# EasyEDA schematic wigler_ariel.json
TITLE: Sheet_1; REV: 1.0; Date: 2025-09-19; Sheet: 1/1; Drawn By: nath8505; Company: Your Company
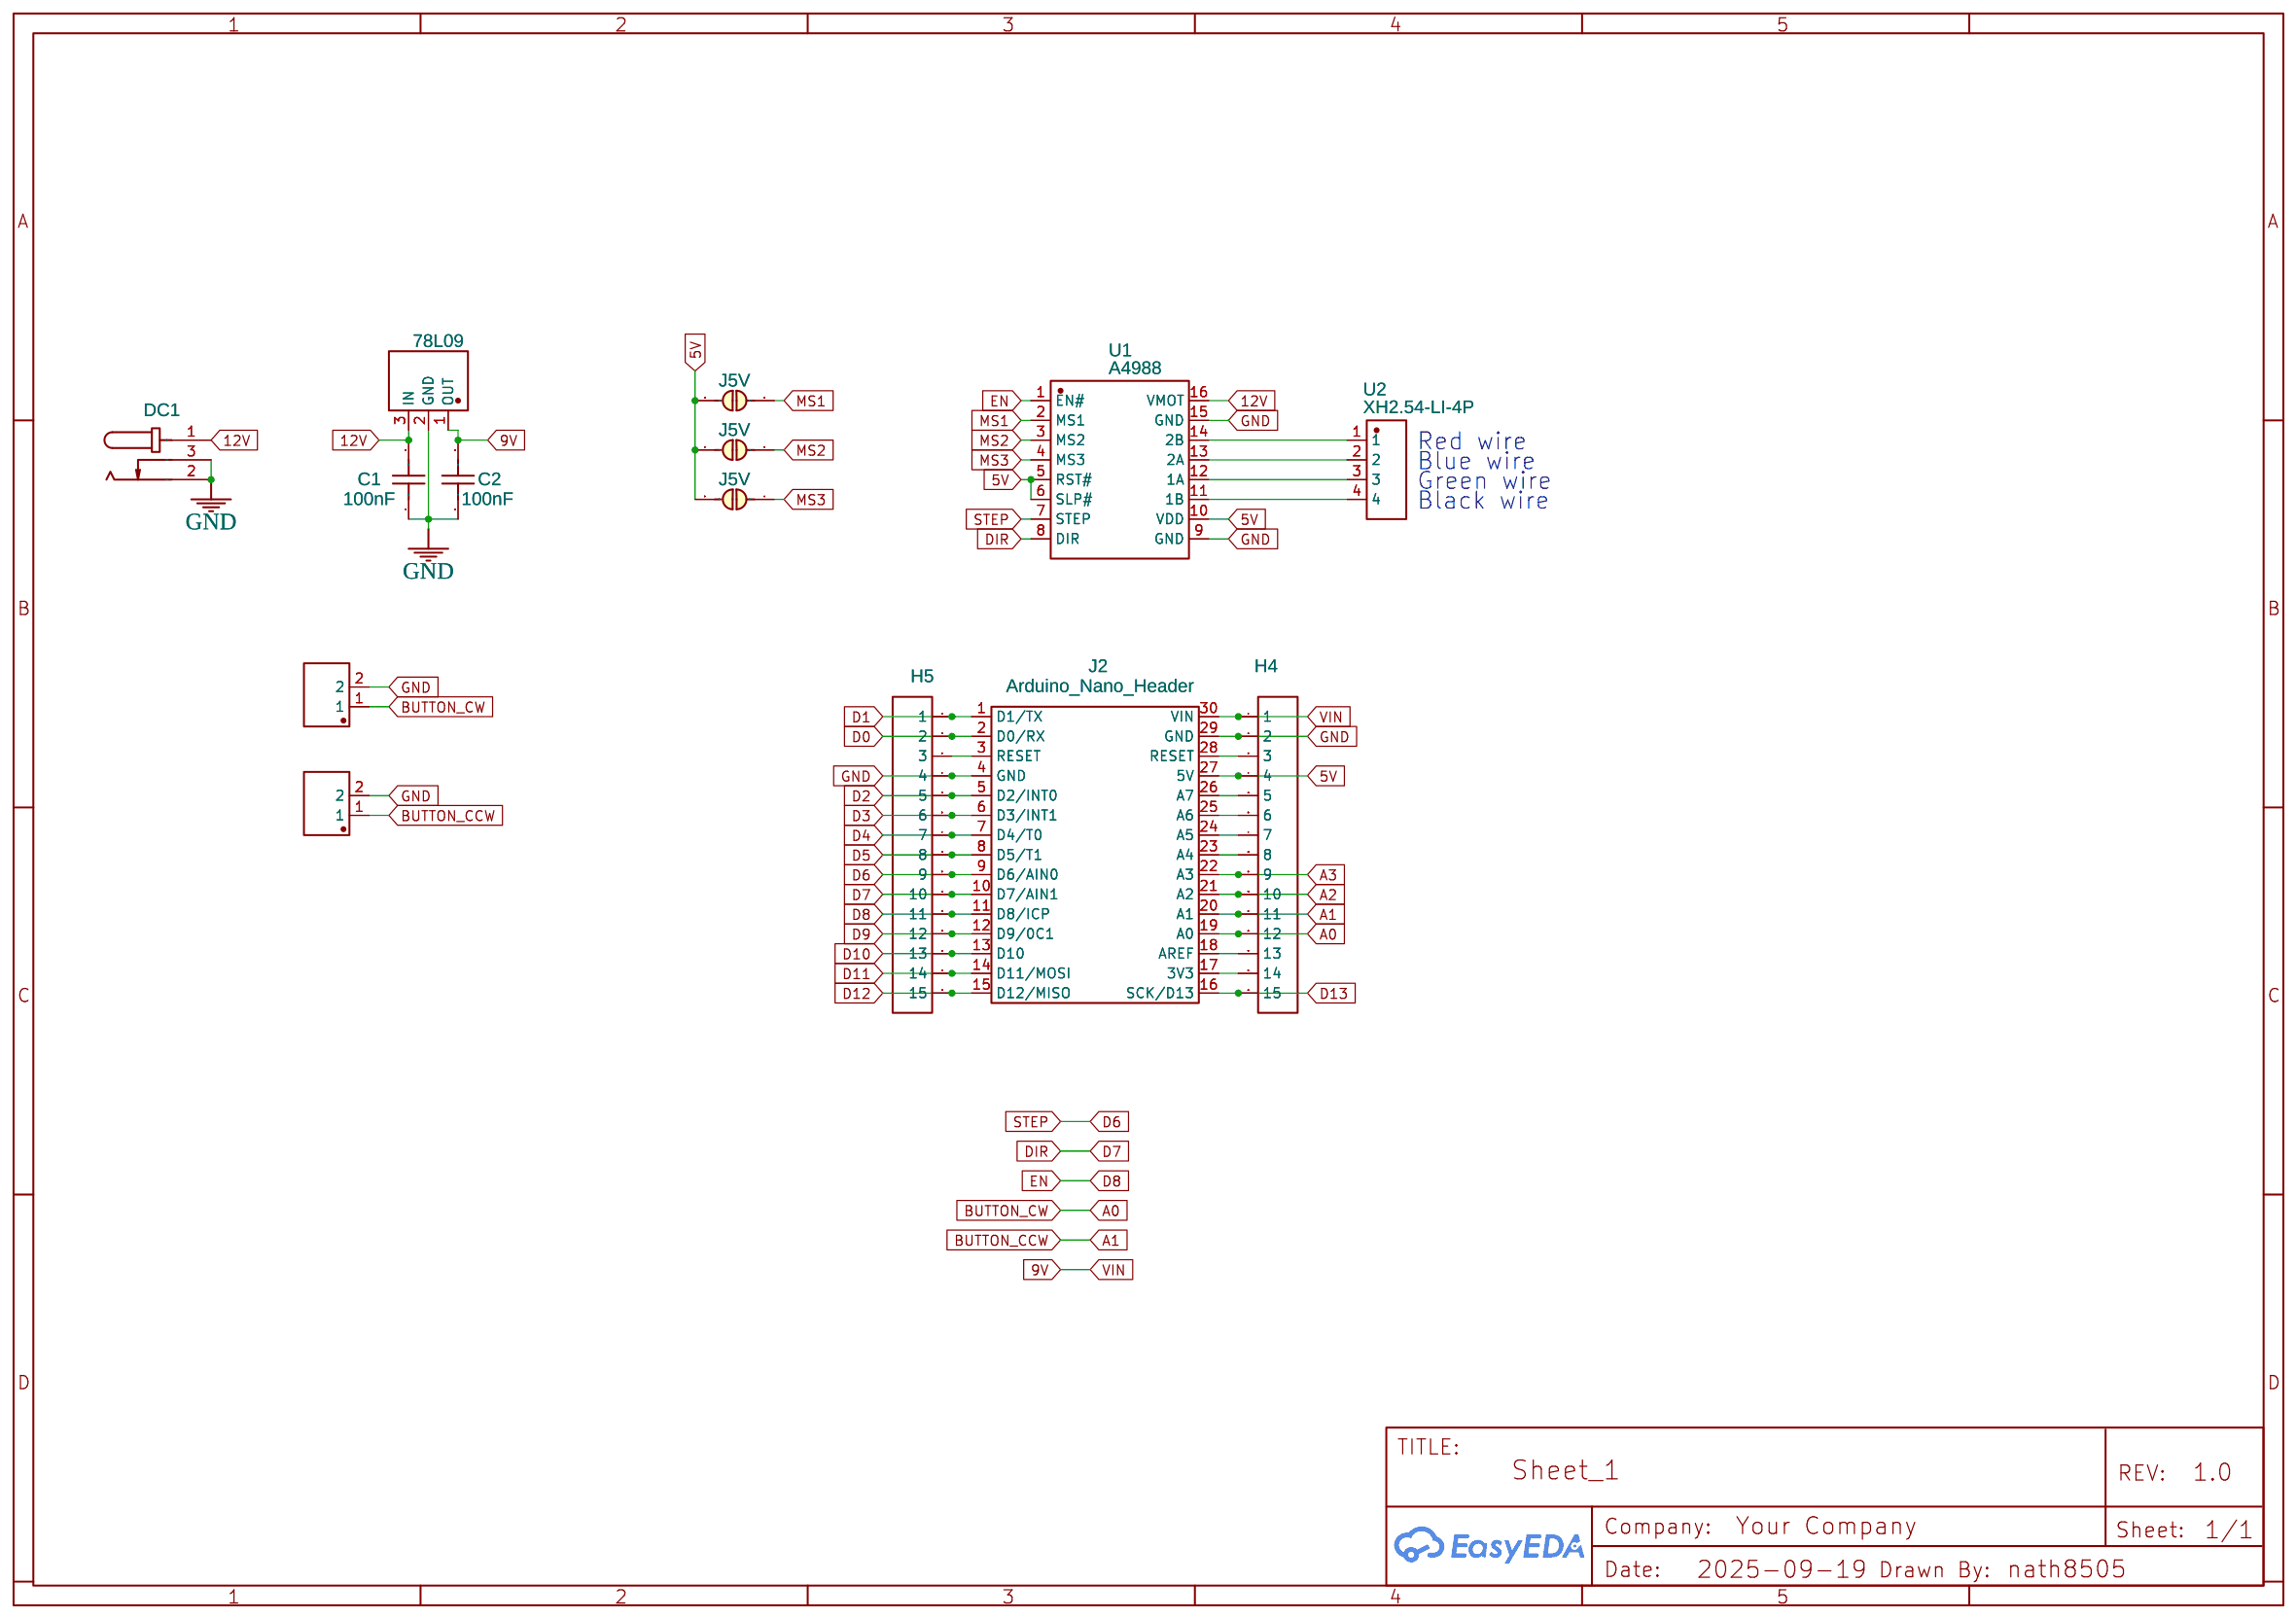
[diagram p0: schematic sheet]

## Parts
C1  100nF  [C0603]
C2  100nF  [C0603]
D7  B+  [CONN-TH_KF2510-2A]
D8  B-  [CONN-TH_KF2510-2A]
DC1  DC  [DC-IN-TH_DC005]
H4  HDR-F-2.54_1x15  [HDR-F-2.54_1X15]
H5  HDR-F-2.54_1x15  [HDR-F-2.54_1X15]
J2  Arduino_Nano_Header  [DIP-30_L43.18-W15.24-ARDUINONANO]
J9V_1  J5V  [JUMPERS_SMT-JUMPER_2_NC_PASTE_NO-SILK]
J9V_2  J5V  [JUMPERS_SMT-JUMPER_2_NC_PASTE_NO-SILK]
J9V_3  J5V  [JUMPERS_SMT-JUMPER_2_NC_PASTE_NO-SILK]
U1  A4988  [DIP-16_L20.3-W15.2-P2.54_LS12.7_A4988]
U2  XH2.54-LI-4P  [CONN-TH_4P-P2.54-XH2.54-LI-4P]
U3  78L09  [SOT-89-3_L4.5-W2.5-P1.50-LS4.0-BR]

## Library data of the parts
C1 C2 = CC0603KRX7R9BB104: Supplier: LCSC; Manufacturer: YAGEO(国巨); Supplier Part: C14663; JLCPCB Part Class: Basic Part
D7 D8 = KF2510-2A: Supplier: LCSC; Manufacturer: BOOMELE; Supplier Part: C27543; JLCPCB Part Class: Extended Part; Package Display: No
DC1 = DC005-2.0MM: Supplier: LCSC; Manufacturer: SOFNG; Supplier Part: C111567; Package Display: No
H4 H5 = HDR-F-2.54_1x15: Supplier Part: C124408; Supplier: LCSC; Contributor: LCEDA_Lib; Package Display: No
J2 = Arduino_Nano_Header
J9V_1-J9V_3 = JUMPER-SMT_2: Contributor: P-Thomsen; Package Display: No
U1 = A4988: Supplier: LCSC; Supplier Part: C9900168373; Manufacturer: null; Contributor: lcsc
U2 = XH2.54-LI-4P: Contributor: LCSC; Supplier: LCSC; Supplier Part: C9900008626; Manufacturer: null; JLCPCB Part Class: Extended Part
U3 = 78L09U 78L09: Contributor: LCSC; Supplier: LCSC; Supplier Part: C2875177; Manufacturer: CBI(创基); JLCPCB Part Class: Extended Part; Package Display: No

## Nets
5V: H4.4 J2.27(5V) J9V_1.2 J9V_2.2 J9V_3.2 U1.5(RST#) U1.6(SLP#) U1.10(VDD)
9V: C2.2 H4.1 J2.30(VIN) U3.1(OUT)
12V: C1.2 DC1.1 U1.16(VMOT) U3.3(IN)
GND: C1.1 C2.1 D7.2 D8.2 DC1.2 DC1.3 H4.2 H5.4 J2.4(GND) J2.29(GND) U1.9(GND) U1.15(GND) U3.2(GND)
A0: D7.1 H4.12 J2.19(A0)
A1: D8.1 H4.11 J2.20(A1)
A2: H4.10 J2.21(A2)
A3: H4.9 J2.22(A3)
D0: H5.2 J2.2(D0/RX)
D1: H5.1 J2.1(D1/TX)
D2: H5.5 J2.5(D2/INT0)
D3: H5.6 J2.6(D3/INT1)
D4: H5.7 J2.7(D4/T0)
D5: H5.8 J2.8(D5/T1)
D6: H5.9 J2.9(D6/AIN0) U1.7(STEP)
D7: H5.10 J2.10(D7/AIN1) U1.8(DIR)
D8: H5.11 J2.11(D8/ICP) U1.1(EN#)
D9: H5.12 J2.12(D9/0C1)
D10: H5.13 J2.13(D10)
D11: H5.14 J2.14(D11/MOSI)
D12: H5.15 J2.15(D12/MISO)
D13: H4.15 J2.16(SCK/D13)
MS1: J9V_1.1 U1.2(MS1)
MS2: J9V_2.1 U1.3(MS2)
MS3: J9V_3.1 U1.4(MS3)
Net-(H4-3): H4.3 J2.28(RESET)
Net-(H4-5): H4.5 J2.26(A7)
Net-(H4-6): H4.6 J2.25(A6)
Net-(H4-7): H4.7 J2.24(A5)
Net-(H4-8): H4.8 J2.23(A4)
Net-(H4-13): H4.13 J2.18(AREF)
Net-(H4-14): H4.14 J2.17(3V3)
Net-(H5-3): H5.3 J2.3(RESET)
Net-(U1-11): U1.11(1B) U2.4
Net-(U1-12): U1.12(1A) U2.3
Net-(U1-13): U1.13(2A) U2.2
Net-(U1-14): U1.14(2B) U2.1

## Notes on the sheet
- Red wire
- Blue wire
- Black wire
- Green wire
